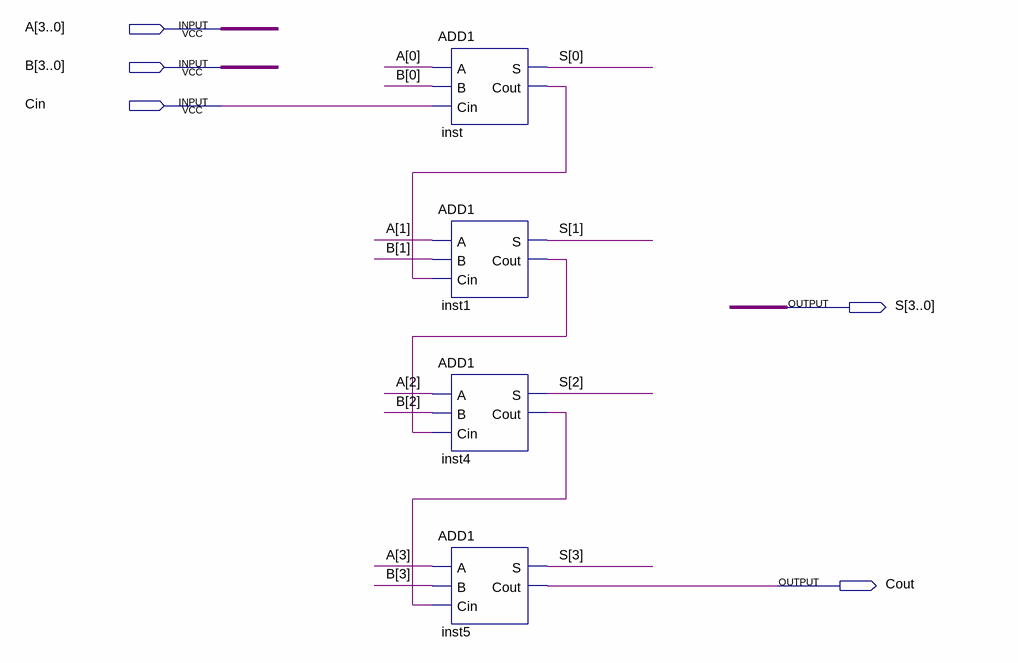
[diagram p0: schematic sheet]
// Quartus schematic ADD4.bdf as structural Verilog: 4 symbols, 5 pins
module ADD4 (
  input  [3:0] A,
  input  [3:0] B,
  input  Cin,
  output [3:0] S,
  output Cout
);

  wire inst1_cout, inst4_cout, inst_cout;

  ADD1 inst (.A(A[0]), .B(B[0]), .Cin(Cin), .S(S[0]), .Cout(inst_cout));
  ADD1 inst1 (.A(A[1]), .B(B[1]), .Cin(inst_cout), .S(S[1]), .Cout(inst1_cout));
  ADD1 inst4 (.A(A[2]), .B(B[2]), .Cin(inst1_cout), .S(S[2]), .Cout(inst4_cout));
  ADD1 inst5 (.A(A[3]), .B(B[3]), .Cin(inst4_cout), .S(S[3]), .Cout(Cout));
endmodule
